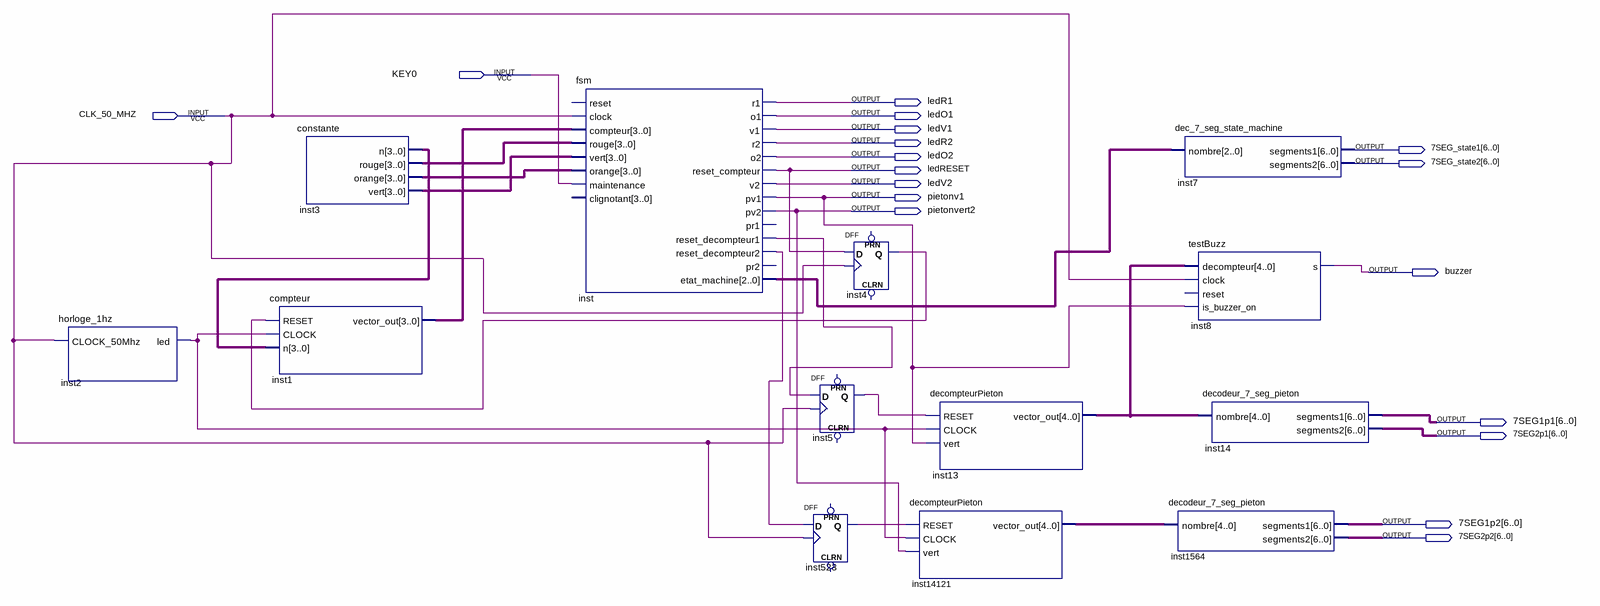
[diagram p0: schematic sheet]
// Quartus schematic testFsm.bdf as structural Verilog: 13 symbols, 18 pins
module testFsm (
  input  KEY0,
  input  CLK_50_MHZ,
  output ledR1,
  output ledO1,
  output ledV1,
  output ledR2,
  output [6:0] \7SEG_state1 ,
  output ledO2,
  output [6:0] \7SEG_state2 ,
  output ledRESET,
  output ledV2,
  output pietonv1,
  output pietonvert2,
  output buzzer,
  output [6:0] \7SEG1p1 ,
  output [6:0] \7SEG2p1 ,
  output [6:0] \7SEG1p2 ,
  output [6:0] \7SEG2p2 
);

  wire inst2_led, inst4_q, inst5_q, inst523_q, inst_reset_decompteur1, inst_reset_decompteur2;
  wire [2:0] inst_etat_machine;
  wire [3:0] inst1_vector_out, inst3_n, inst3_orange, inst3_rouge, inst3_vert;
  wire [4:0] inst13_vector_out, inst14121_vector_out;

  horloge_1hz inst2 (.CLOCK_50Mhz(CLK_50_MHZ), .led(inst2_led));
  constante inst3 (.n(inst3_n), .rouge(inst3_rouge), .orange(inst3_orange), .vert(inst3_vert));
  compteur inst1 (.RESET(inst4_q), .CLOCK(inst2_led), .n(inst3_n), .vector_out(inst1_vector_out));
  fsm inst (
    .clock(CLK_50_MHZ), .compteur(inst1_vector_out), .rouge(inst3_rouge), .vert(inst3_vert),
    .orange(inst3_orange), .maintenance(KEY0), .r1(ledR1), .o1(ledO1), .v1(ledV1), .r2(ledR2), .o2(ledO2),
    .reset_compteur(ledRESET), .v2(ledV2), .pv1(pietonv1), .pv2(pietonvert2),
    .reset_decompteur1(inst_reset_decompteur1), .reset_decompteur2(inst_reset_decompteur2),
    .etat_machine(inst_etat_machine));  // open: reset, clignotant, pr1, pr2
  DFF inst4 (.CLK(CLK_50_MHZ), .D(ledRESET), .Q(inst4_q));  // open: CLRN, PRN
  DFF inst5 (.CLK(CLK_50_MHZ), .D(inst_reset_decompteur1), .Q(inst5_q));  // open: CLRN, PRN
  DFF inst523 (.CLK(CLK_50_MHZ), .D(inst_reset_decompteur2), .Q(inst523_q));  // open: CLRN, PRN
  decompteurPieton inst13 (.RESET(inst5_q), .CLOCK(inst2_led), .vert(pietonv1), .vector_out(inst13_vector_out));
  decompteurPieton inst14121 (
    .RESET(inst523_q), .CLOCK(inst2_led), .vert(pietonvert2), .vector_out(inst14121_vector_out));
  dec_7_seg_state_machine inst7 (.nombre(inst_etat_machine), .segments1(\7SEG_state1 ), .segments2(\7SEG_state2 ));
  decodeur_7_seg_pieton inst1564 (.nombre(inst14121_vector_out), .segments1(\7SEG1p2 ), .segments2(\7SEG2p2 ));
  testBuzz inst8 (
    .decompteur(inst13_vector_out), .clock(CLK_50_MHZ), .is_buzzer_on(pietonv1), .s(buzzer));  // open: reset
  decodeur_7_seg_pieton inst14 (.nombre(inst13_vector_out), .segments1(\7SEG1p1 ), .segments2(\7SEG2p1 ));
endmodule
